# EAGLE design MCU-PCB-schematic (EAGLE 8.1.0)
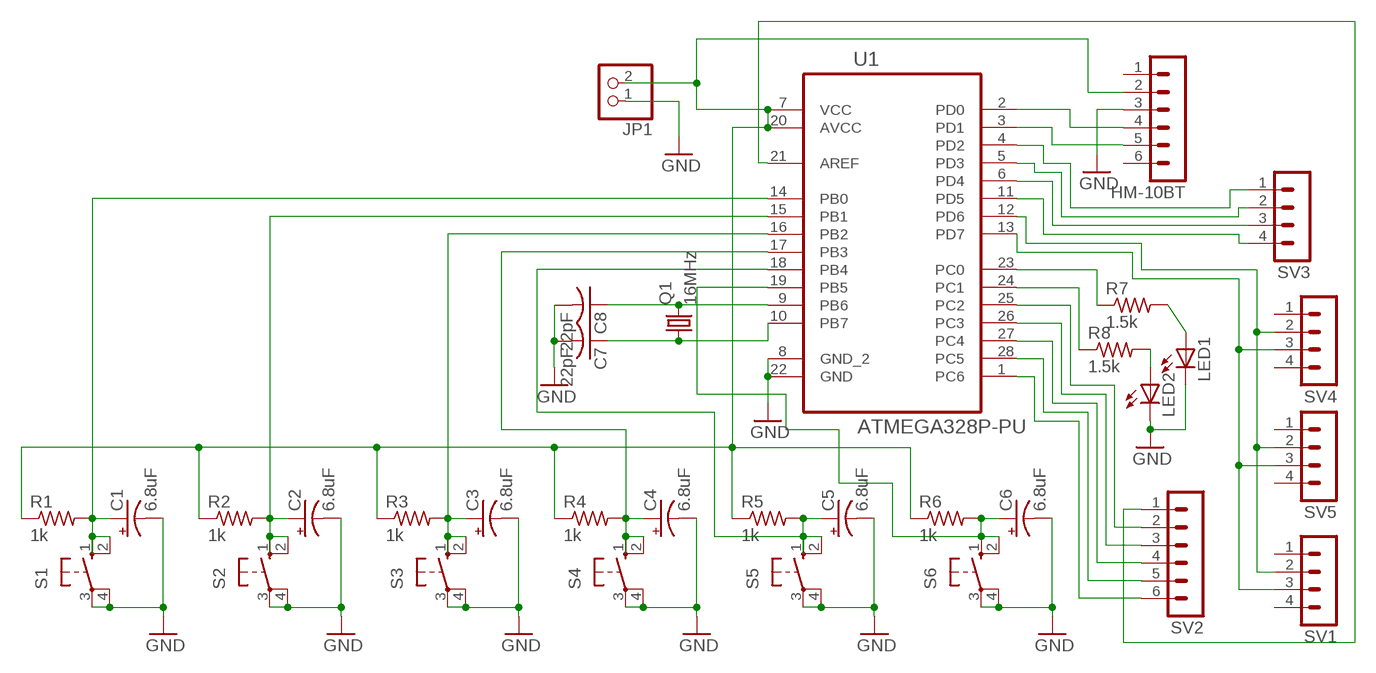
[diagram p0: schematic, sheet 1]

## Parts
C1  6.8uF  CPOL-USE2.5-5  [E2,5-5]
C2  6.8uF  CPOL-USE2.5-5  [E2,5-5]
C3  6.8uF  CPOL-USE2.5-5  [E2,5-5]
C4  6.8uF  CPOL-USE2.5-5  [E2,5-5]
C5  6.8uF  CPOL-USE2.5-5  [E2,5-5]
C6  6.8uF  CPOL-USE2.5-5  [E2,5-5]
C7  22pF  C-US025-024X044  [C025-024X044]
C8  22pF  C-US025-024X044  [C025-024X044]
HM-10BT  MA06-1  [MA06-1]
JP1  PINHD-1X2  [1X02]
LED1  LED5MM  [LED5MM]
LED2  LED5MM  [LED5MM]
Q1  16MHz  CRYSTALHC49S  [HC49/S]
R1  1k  R-US_0207/10  [0207/10]
R2  1k  R-US_0207/10  [0207/10]
R3  1k  R-US_0207/10  [0207/10]
R4  1k  R-US_0207/10  [0207/10]
R5  1k  R-US_0207/10  [0207/10]
R6  1k  R-US_0207/10  [0207/10]
R7  1.5k  R-US_0207/10  [0207/10]
R8  1.5k  R-US_0207/10  [0207/10]
S1  10-XX  [B3F-10XX]
S2  10-XX  [B3F-10XX]
S3  10-XX  [B3F-10XX]
S4  10-XX  [B3F-10XX]
S5  10-XX  [B3F-10XX]
S6  10-XX  [B3F-10XX]
SV1  MA04-1  [MA04-1]
SV2  MA06-1  [MA06-1]
SV3  MA04-1  [MA04-1]
SV4  MA04-1  [MA04-1]
SV5  MA04-1  [MA04-1]
U1  ATMEGA328P-PU  [DIP254P762X457-28]

## Nets
GND: C1.- C2.- C3.- C4.- C5.- C6.- C7.2 C8.2 HM-10BT.3 JP1.1 LED1.K(C) LED2.K(C) S1.3(P) S1.4(P1) S2.3(P) S2.4(P1) S3.3(P) S3.4(P1) S4.3(P) S4.4(P1) S5.3(P) S5.4(P1) S6.3(P) S6.4(P1) U1.8(GND_2) U1.22(GND)
N$1: HM-10BT.2 JP1.2 R1.1 R2.1 R3.1 R4.1 R5.1 R6.1 U1.7(VCC) U1.20(AVCC)
N$2: C1.+ R1.2 S1.1(S) S1.2(S1) U1.14(PB0)
N$6: C5.+ R5.2 S5.1(S) S5.2(S1) U1.18(PB4)
N$7: C6.+ R6.2 S6.1(S) S6.2(S1) U1.19(PB5)
N$8: C8.1 Q1.2 U1.9(PB6)
N$9: C7.1 Q1.1 U1.10(PB7)
N$10: HM-10BT.4 U1.2(PD0)
N$11: HM-10BT.5 U1.3(PD1)
N$12: R7.1 U1.23(PC0)
N$13: R8.1 U1.24(PC1)
N$14: LED1.A R7.2
N$15: LED2.A R8.2
N$16: SV1.3 SV4.3 SV5.3 U1.13(PD7)
N$17: SV1.2 SV4.2 SV5.2 U1.12(PD6)
N$18: SV2.2 U1.25(PC2)
N$19: SV2.3 U1.26(PC3)
N$20: SV2.4 U1.27(PC4)
N$21: SV2.5 U1.28(PC5)
N$22: SV2.6 U1.1(PC6)
N$23: SV2.1 U1.21(AREF)
N$24: C3.+ R3.2 S3.1(S) S3.2(S1) U1.16(PB2)
N$25: SV3.2 U1.5(PD3)
N$26: SV3.3 U1.6(PD4)
N$27: SV3.4 U1.11(PD5)
N$28: SV3.1 U1.4(PD2)
N$30: C2.+ R2.2 S2.1(S) S2.2(S1) U1.15(PB1)
N$31: C4.+ R4.2 S4.1(S) S4.2(S1) U1.17(PB3)
Unconnected: HM-10BT.1 HM-10BT.6 SV1.1 SV1.4 SV4.1 SV4.4 SV5.1 SV5.4

## Library data of the parts
C1-C6 = rcl:CPOL-US: POLARIZED CAPACITOR, American symbol
C7 C8 = rcl:C-US: CAPACITOR, American symbol
HM-10BT SV2 = con-lstb:MA06-1: PIN HEADER; OC_FARNELL: unknown; OC_NEWARK: unknown
JP1 = pinhead:PINHD-1X2: PIN HEADER
LED1 LED2 = led:LED: LED OSRAM: - CHIPLED LG R971, LG N971, LY N971, LG Q971, LY Q971, LO R971, LY R971 LH N974, LH R974 LS Q976, LO Q976, LY Q976 LO Q996 - Hyper CHIPLED LW Q18S LB Q993, LB Q99A, LB R99A - SideLED LS A670, LO A670, LY A670, LG A670, LP A670 LB A673, LV A673, LT A673, LW A673 LH A674 LY A675 LS A676, LA A676, LO A676, LY A676, LW A676 LS A679, LY A679, LG A679 - Hyper Micro SIDELED® LS Y876, LA Y876, LO Y876, LY Y876 LT Y87S - SmartLED LW L88C, LW L88S LB L89C, LB L89S, LG L890 LS L89K, LO L89K, LY L89K LS L896, LA L896, LO L896, LY L896 - TOPLED LS T670, LO T670, LY T670, LG T670, LP T670 LSG T670, LSP T670, LSY T670, LOP T670, LYG T670 LG T671, LOG T671, LSG T671 LB T673, LV T673, LT T673, LW T673 LH T674 LS T676, LA T676, LO T676, LY T676, LB T676, LH T676, LSB T676, LW T676 LB T67C, LV T67C, LT T67C, LS T67K, LO T67K, LY T67K, LW E67C LS E67B, LA E67B, LO E67B, LY E67B, LB E67C, LV E67C, LT E67C LW T67C LS T679, LY T679, LG T679 LS T770, LO T770, LY T770, LG T770, LP T770 LB T773, LV T773, LT T773, LW T773 LH T774 LS E675, LA E675, LY E675, LS T675 LS T776, LA T776, LO T776, LY T776, LB T776 LHGB T686 LT T68C, LB T68C - Hyper Mini TOPLED® LB M676 - Mini TOPLED Santana® LG M470 LS M47K, LO M47K, LY M47K Source: http://www.osram.convergy.de LUXEON: - LUMILED® LXK2-PW12-R00, LXK2-PW12-S00, LXK2-PW14-U00, LXK2-PW14-V00 LXK2-PM12-R00, LXK2-PM12-S00, LXK2-PM14-U00 LXK2-PE12-Q00, LXK2-PE12-R00, LXK2-PE12-S00, LXK2-PE14-T00, LXK2-PE14-U00 LXK2-PB12-K00, LXK2-PB12-L00, LXK2-PB12-M00, LXK2-PB14-N00, LXK2-PB14-P00, LXK2-PB14-Q00 LXK2-PR12-L00, LXK2-PR12-M00, LXK2-PR14-Q00, LXK2-PR14-R00 LXK2-PD12-Q00, LXK2-PD12-R00, LXK2-PD12-S00 LXK2-PH12-R00, LXK2-PH12-S00 LXK2-PL12-P00, LXK2-PL12-Q00, LXK2-PL12-R00 Source: www.luxeon.com KINGBRIGHT: KA-3528ASYC Source: www.kingbright.com
Q1 = crystal:CRYSTAL: CRYSTAL; OC_FARNELL: 1667008; OC_NEWARK: unknown
R1-R8 = rcl:R-US_: RESISTOR, American symbol
S1-S6 = switch-omron:10-XX: OMRON SWITCH; MPN: B3F-1000; OC_FARNELL: 176432; OC_NEWARK: 36M3542
SV1 SV3-SV5 = con-lstb:MA04-1: PIN HEADER; OC_FARNELL: unknown; OC_NEWARK: unknown
U1 = Atmel_By_element14_Batch_1-00:ATMEGA328P-PU: 8-bit Microcontroller with In-System Programmable Flash; MPN: ATMEGA328P-PU; OC_FARNELL: 1715487; OC_NEWARK: 15R0268; PACKAGE: PDIP-28; SUPPLIER: Atmel

## Board
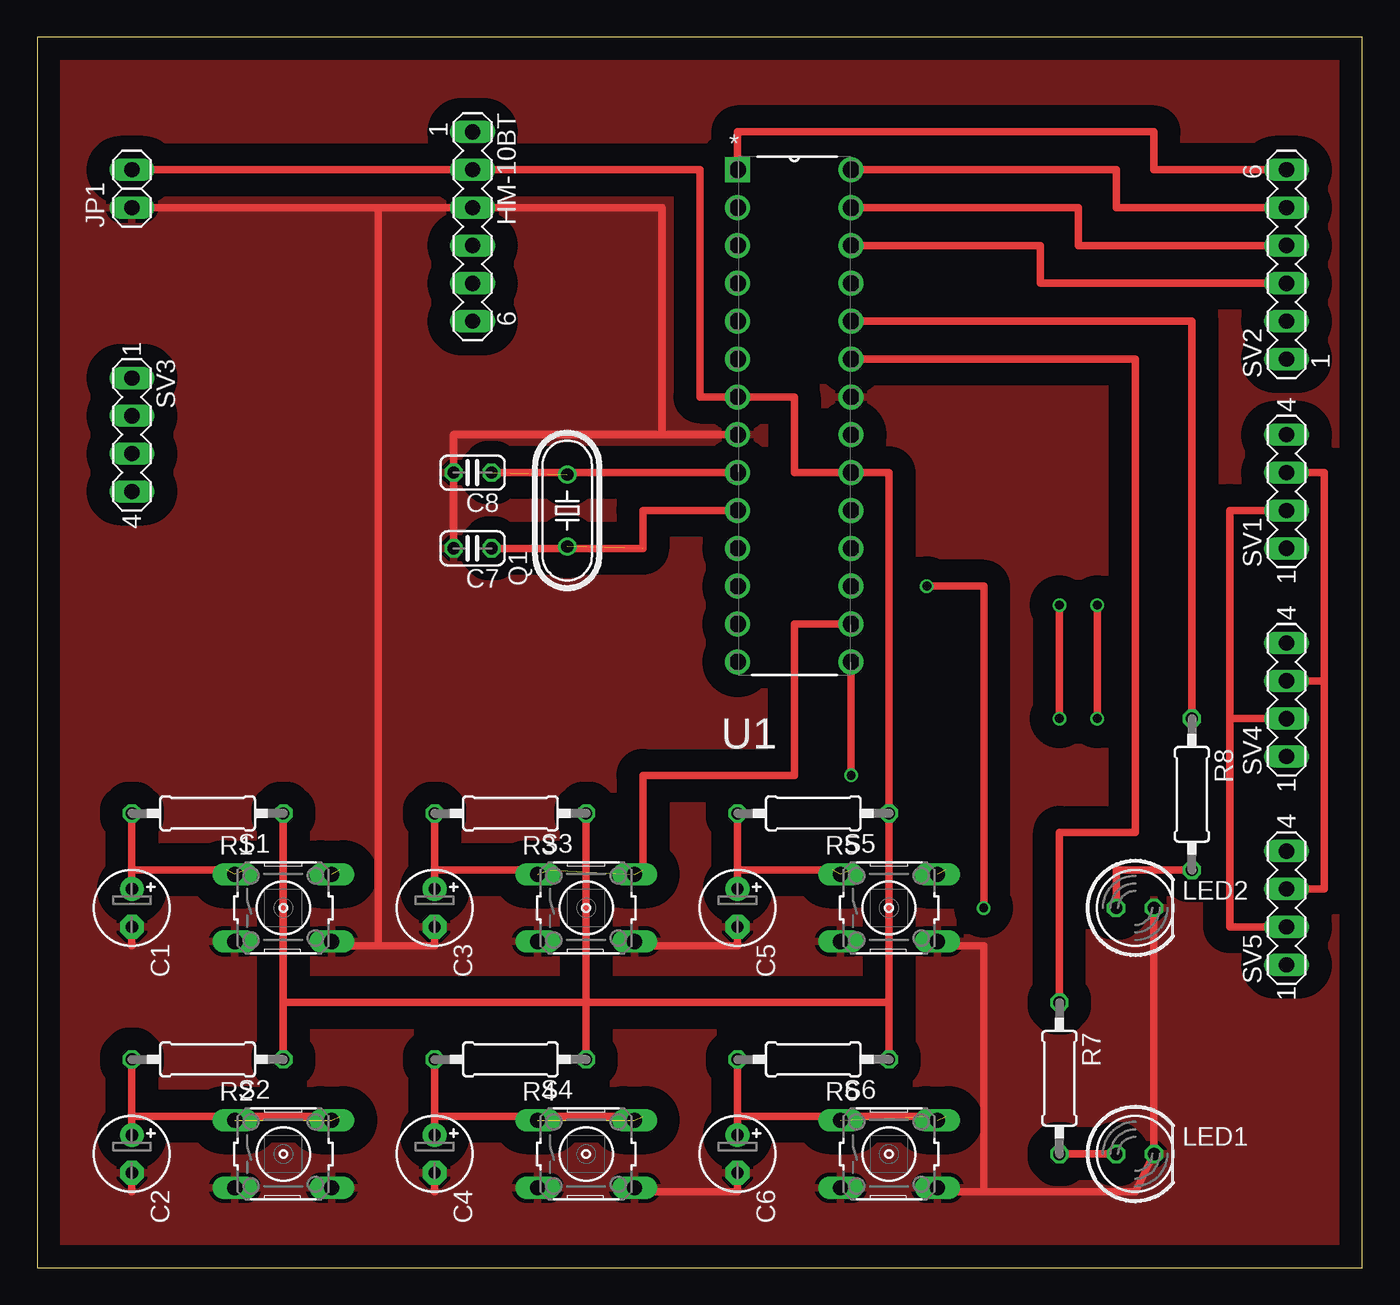
[diagram p1: board, top side]
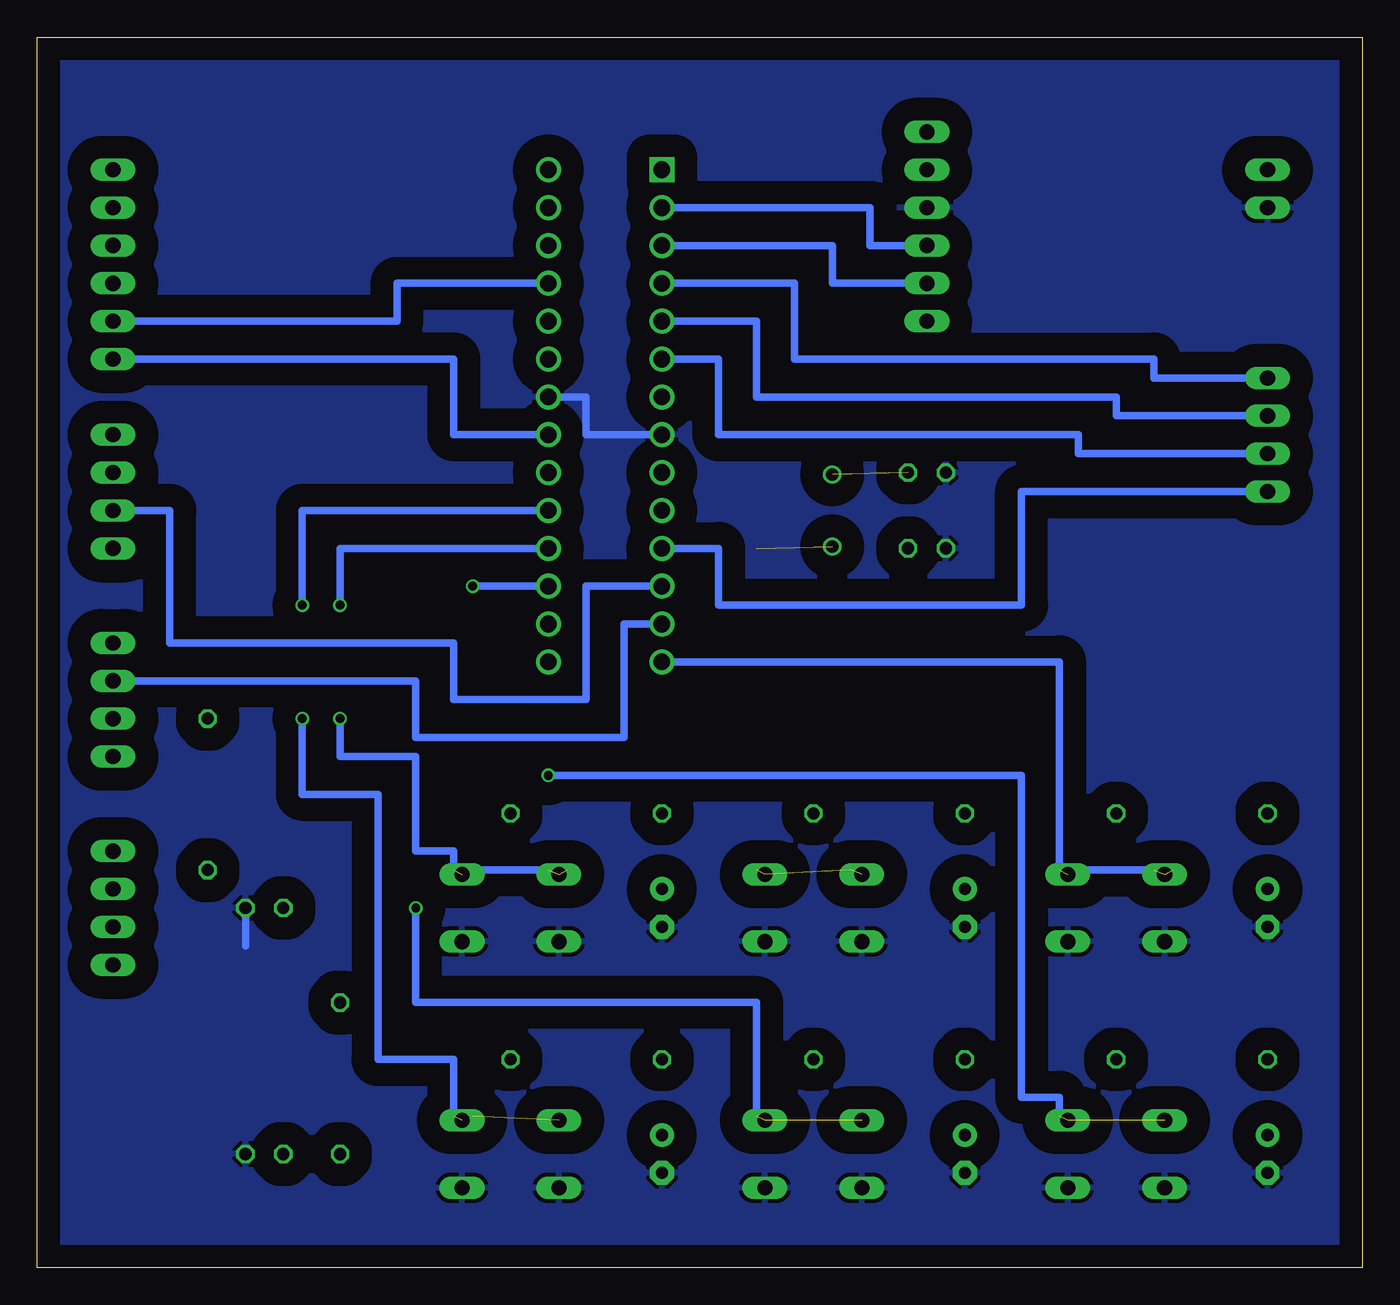
[diagram p2: board, bottom side, seen from below]

Size 88.9 x 82.55 mm. Coordinates in mm from the lower left corner, seen from the top.
Outline: 0,0 88.9,0 88.9,82.55 0,82.55 0,0
Copper layers (1*16): Top 0.035mm / dielectric 1.5mm / Bottom 0.035mm
Design rules "PCBWay_2layer": minimum track width 6mil, minimum drill 0.3mm, track to track 6mil, track to pad 6mil, pad to pad 6mil, via to via 6mil, smd to smd 4mil, copper to edge 10mil, drill to drill 6mil, minimum pad ring 6mil, minimum via ring 6mil, stop-mask expansion 4mil, vias tented up to drill 0.8mm, thermal gap 10mil

### Footprints (pad centres in the part's own frame; a part is rotated, then mirrored left to right if it is on the bottom)
E2,5-5 = drill 0.813 pad 1.6: + -1.27,0 | drill 0.813 pad 1.6 octagon: - 1.27,0
C025-024X044 = drill 0.813 octagon: 1 -1.27,0; 2 1.27,0
MA06-1 = drill 1.016 long: 1 -6.35,0; 2 -3.81,0; 3 -1.27,0; 4 1.27,0; 5 3.81,0; 6 6.35,0
1X02 = drill 1.016 long: 1 -1.27,0; 2 1.27,0
LED5MM = drill 0.813 octagon: A -1.27,0; K 1.27,0
HC49/S = drill 0.813: 1 -2.413,0; 2 2.413,0
0207/10 = drill 0.813 octagon: 1 -5.08,0; 2 5.08,0
B3F-10XX = drill 1.016 long: 1 -3.251,2.261; 2 3.251,2.261; 3 -3.251,-2.261; 4 3.251,-2.261
MA04-1 = drill 1.016 long: 1 -3.81,0; 2 -1.27,0; 3 1.27,0; 4 3.81,0
DIP254P762X457-28 = drill 1.118 square: 1 -7.62,33.02 | drill 1.118: 2 -7.62,30.48; 3 -7.62,27.94; 4 -7.62,25.4; 5 -7.62,22.86; 6 -7.62,20.32; 7 -7.62,17.78; 8 -7.62,15.24; 9 -7.62,12.7; 10 -7.62,10.16; 11 -7.62,7.62; 12 -7.62,5.08; 13 -7.62,2.54; 14 -7.62,0; 15 0,0; 16 0,2.54; 17 0,5.08; 18 0,7.62; 19 0,10.16; 20 0,12.7; 21 0,15.24; 22 0,17.78; 23 0,20.32; 24 0,22.86; 25 0,25.4; 26 0,27.94; 27 0,30.48; 28 0,33.02

### Placement (x,y rotation side)
C1  6.35,24.13 270 top
C2  6.35,7.62 270 top
C3  26.67,24.13 270 top
C4  26.67,7.62 270 top
C5  46.99,24.13 270 top
C6  46.99,7.62 270 top
C7  29.21,48.26 180 top
C8  29.21,53.34 180 top
HM-10BT  29.21,69.85 270 top
JP1  6.35,72.39 90 top
LED1  73.66,7.62 0 top
LED2  73.66,24.13 0 top
Q1  35.56,50.8 90 top
R1  11.43,30.48 180 top
R2  11.43,13.97 180 top
R3  31.75,30.48 180 top
R4  31.75,13.97 180 top
R5  52.07,30.48 180 top
R6  52.07,13.97 180 top
R7  68.58,12.7 270 top
R8  77.47,31.75 270 top
S1  16.51,24.13 0 top
S2  16.51,7.62 0 top
S3  36.83,24.13 0 top
S4  36.83,7.62 0 top
S5  57.15,24.13 0 top
S6  57.15,7.62 0 top
SV1  83.82,52.07 90 top
SV2  83.82,67.31 90 top
SV3  6.35,55.88 270 top
SV4  83.82,38.1 90 top
SV5  83.82,24.13 90 top
U1  54.61,40.64 0 top

### Tracks (layer width: path | path; a pad name or v marks a point on that pad's centre or on a via)
GND
  Top 0.508: 6.35,21.59 C1.- | 19.05,21.59 22.86,21.59 | 22.86,21.59 26.67,21.59 C3.- | 6.35,5.08 C2.- | 26.67,5.08 C4.- | 40.64,5.08 46.99,5.08 C6.- | 59.69,5.08 63.5,5.08 | 63.5,5.08 73.66,5.08 LED1.K LED2.K | C7.2 C8.2 27.94,55.88 U1.8 41.91,55.88 41.91,71.12 HM-10BT.3 22.86,71.12 | 22.86,71.12 22.86,21.59 | 59.69,21.59 63.5,21.59 63.5,5.08 | JP1.1 22.86,71.12 | 40.64,21.59 46.99,21.59 C5.-
  Bottom 0.508: U1.8 52.07,55.88 52.07,58.42 U1.22 | 74.93,21.59 LED2.K
  pour Top (isolate 1.524): 0,82.55 88.9,82.55 88.9,0 0,0
  pour Bottom (isolate 1.524): 0,82.55 88.9,82.55 88.9,0 0,0
N$1
  Top 0.508: R3.1 36.83,17.78 | R1.1 16.51,17.78 | 16.51,17.78 R2.1 | 16.51,17.78 36.83,17.78 | 36.83,17.78 R4.1 | 36.83,17.78 57.15,17.78 R6.1 R5.1 57.15,53.34 U1.20 50.8,53.34 50.8,58.42 U1.7 44.45,58.42 44.45,73.66 HM-10BT.2 JP1.2
N$2  (3 unrouted)
  Top 0.508: R1.2 C1.+ 6.35,26.67 13.97,26.67
  Bottom 0.508: U1.14 20.32,40.64 20.32,26.67 12.7,26.67
N$6  (via drill 0.6)  (3 unrouted)
  Top 0.508: 54.61,26.67 46.99,26.67 C5.+ R5.2 | v68.58,44.45 v68.58,36.83
  Bottom 0.508: U1.18 68.58,48.26 v68.58,44.45 | v68.58,36.83 68.58,34.29 63.5,34.29 63.5,27.94 60.96,27.94 60.96,26.67 53.34,26.67
N$7  (via drill 0.6)  (3 unrouted)
  Top 0.508: R6.2 C6.+ 46.99,10.16 60.96,10.16 | v71.12,44.45 v71.12,36.83
  Bottom 0.508: U1.19 71.12,50.8 v71.12,44.45 | v71.12,36.83 71.12,31.75 66.04,31.75 66.04,13.97 60.96,13.97 60.96,10.16 59.69,10.16
N$8  (1 unrouted)
  Top 0.508: U1.9 C8.1
N$9  (1 unrouted)
  Top 0.508: U1.10 40.64,50.8 40.64,48.26 C7.1
N$10
  Bottom 0.508: HM-10BT.4 33.02,68.58 33.02,71.12 U1.2
N$11
  Bottom 0.508: HM-10BT.5 35.56,66.04 35.56,68.58 U1.3
N$12
  Top 0.508: R7.1 68.58,29.21 73.66,29.21 73.66,60.96 U1.23
N$13
  Top 0.508: U1.24 77.47,63.5 R8.1
N$14
  Top 0.508: LED1.A R7.2
N$15
  Top 0.508: R8.2 72.39,26.67 LED2.A
N$16
  Top 0.508: SV1.3 86.36,53.34 86.36,39.37 | 86.36,39.37 SV4.3 | 86.36,39.37 86.36,25.4 SV5.3
  Bottom 0.508: U1.13 49.53,43.18 49.53,35.56 63.5,35.56 63.5,39.37 SV4.3
N$17
  Top 0.508: SV5.2 80.01,22.86 80.01,36.83 | 80.01,36.83 80.01,50.8 SV1.2 | SV4.2 80.01,36.83
  Bottom 0.508: U1.12 52.07,45.72 52.07,38.1 60.96,38.1 60.96,41.91 80.01,41.91 80.01,50.8 SV1.2
N$18
  Bottom 0.508: SV2.2 64.77,63.5 64.77,66.04 U1.25
N$19
  Top 0.508: SV2.3 67.31,66.04 67.31,68.58 U1.26
N$20
  Top 0.508: SV2.4 69.85,68.58 69.85,71.12 U1.27
N$21
  Top 0.508: SV2.5 72.39,71.12 72.39,73.66 U1.28
N$22
  Top 0.508: SV2.6 74.93,73.66 74.93,76.2 46.99,76.2 U1.1
N$23
  Bottom 0.508: U1.21 60.96,55.88 60.96,60.96 SV2.1
N$24  (3 unrouted)
  Top 0.508: R3.2 C3.+ 26.67,26.67 34.29,26.67 | U1.16 50.8,43.18 50.8,33.02 40.64,33.02 40.64,26.67
N$25
  Bottom 0.508: U1.5 40.64,63.5 40.64,58.42 16.51,58.42 16.51,57.15 SV3.2
N$26
  Bottom 0.508: U1.6 43.18,60.96 43.18,55.88 19.05,55.88 19.05,54.61 SV3.3
N$27
  Bottom 0.508: U1.11 43.18,48.26 43.18,44.45 22.86,44.45 22.86,52.07 SV3.4
N$28
  Bottom 0.508: U1.4 38.1,66.04 38.1,60.96 13.97,60.96 13.97,59.69 SV3.1
N$30  (via drill 0.6)  (3 unrouted)
  Top 0.508: R2.2 C2.+ 6.35,10.16 20.32,10.16 | v54.61,33.02 U1.15
  Bottom 0.508: v54.61,33.02 22.86,33.02 22.86,11.43 20.32,11.43 20.32,10.16
N$31  (via drill 0.6)  (3 unrouted)
  Top 0.508: v59.69,45.72 63.5,45.72 v63.5,24.13 | R4.2 C4.+ 26.67,10.16 40.64,10.16
  Bottom 0.508: v63.5,24.13 63.5,17.78 40.64,17.78 40.64,10.16 | v59.69,45.72 U1.17